# Altium schematic sheet ETL_RB.SchDoc: ETL Readout Board
size A; DrawnBy: anp sxw; Organization: Boston University EDF; DocumentNumber: 1; Revision: 1; SheetNumber: 1; SheetTotal: 1
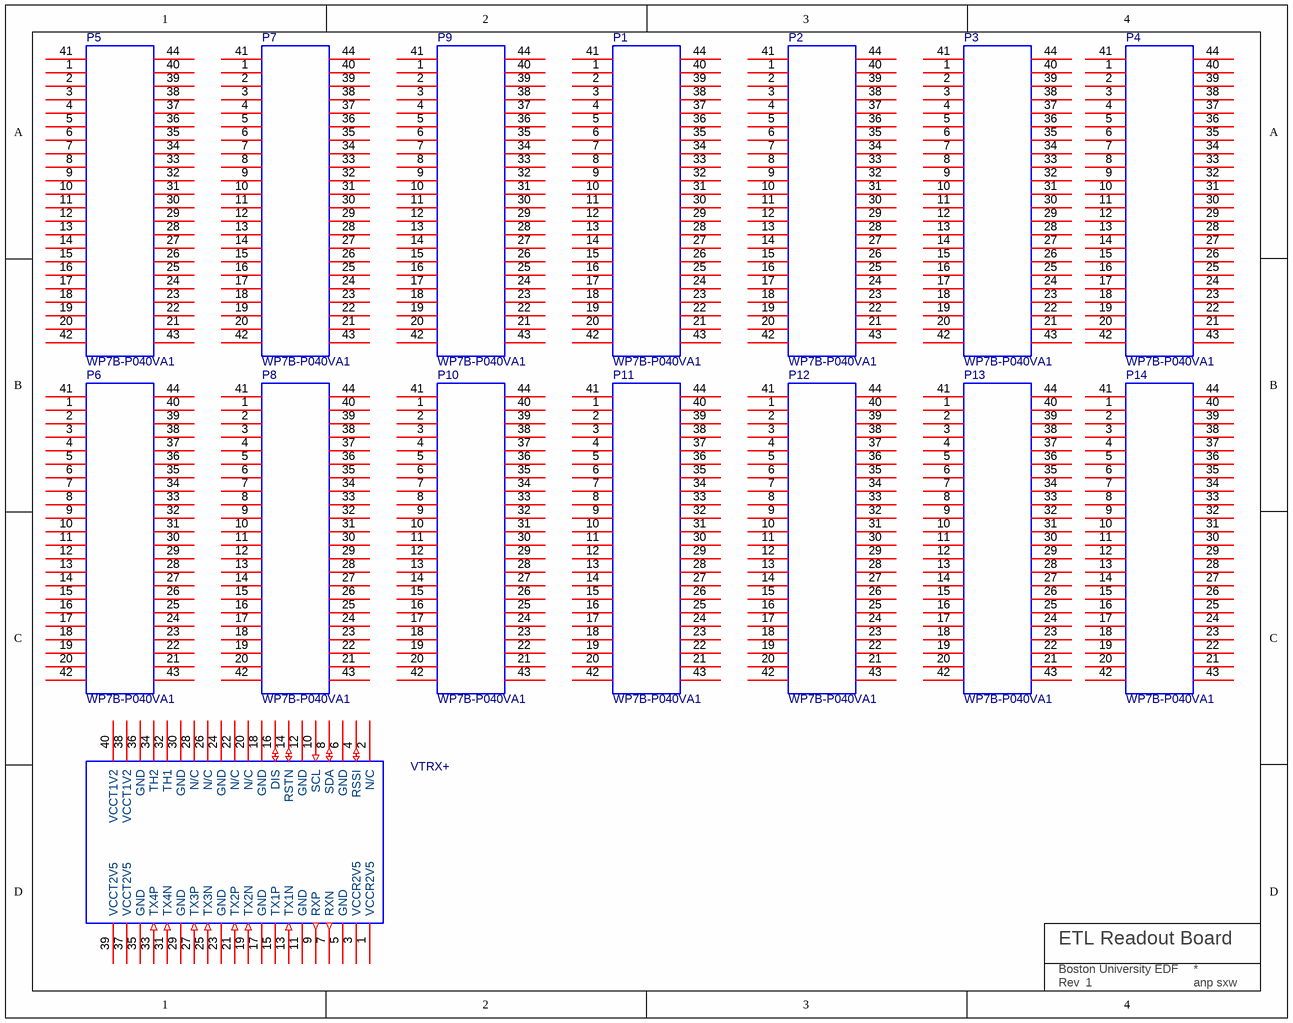
[diagram p0: ETL_RB.SchDoc]

## Parts
?  DF40C-40DS-0.4V  [vtrx+]  (value not drawn)
P1  WP7B-P040VA1  [wp7b-40p]
P2  WP7B-P040VA1  [wp7b-40p]
P3  WP7B-P040VA1  [wp7b-40p]
P4  WP7B-P040VA1  [wp7b-40p]
P5  WP7B-P040VA1  [wp7b-40p]
P6  WP7B-P040VA1  [wp7b-40p]
P7  WP7B-P040VA1  [wp7b-40p]
P8  WP7B-P040VA1  [wp7b-40p]
P9  WP7B-P040VA1  [wp7b-40p]
P10  WP7B-P040VA1  [wp7b-40p]
P11  WP7B-P040VA1  [wp7b-40p]
P12  WP7B-P040VA1  [wp7b-40p]
P13  WP7B-P040VA1  [wp7b-40p]
P14  WP7B-P040VA1  [wp7b-40p]
TBLOCK?  BU Title block  (value not drawn)  (graphical)

## Nets

Not connected (* = marked no-connect by the designer): ? 1(VCCR2V5) 2(N/C) 3(VCCR2V5) 4(RSSI) 5(GND) 6(GND) 7(RXN) 8(SDA) 9(RXP) 10(SCL) 11(GND) 12(GND) 13(TX1N) 14(RSTN) 15(TX1P) 16(DIS) 17(GND) 18(GND) 19(TX2N) 20(N/C) 21(TX2P) 22(N/C) 23(GND) 24(GND) 25(TX3N) 26(N/C) 27(TX3P) 28(N/C) 29(GND) 30(GND) 31(TX4N) 32(TH1) 33(TX4P) 34(TH2) 35(GND) 36(GND) 37(VCCT2V5) 38(VCCT1V2) 39(VCCT2V5) 40(VCCT1V2); P1 1 2 3 4 5 6 7 8 9 10 11 12 13 14 15 16 17 18 19 20 21 22 23 24 25 26 27 28 29 30 31 32 33 34 35 36 37 38 39 40 41 42 43 44; P2 1 2 3 4 5 6 7 8 9 10 11 12 13 14 15 16 17 18 19 20 21 22 23 24 25 26 27 28 29 30 31 32 33 34 35 36 37 38 39 40 41 42 43 44; P3 1 2 3 4 5 6 7 8 9 10 11 12 13 14 15 16 17 18 19 20 21 22 23 24 25 26 27 28 29 30 31 32 33 34 35 36 37 38 39 40 41 42 43 44; P4 1 2 3 4 5 6 7 8 9 10 11 12 13 14 15 16 17 18 19 20 21 22 23 24 25 26 27 28 29 30 31 32 33 34 35 36 37 38 39 40 41 42 43 44; P5 1 2 3 4 5 6 7 8 9 10 11 12 13 14 15 16 17 18 19 20 21 22 23 24 25 26 27 28 29 30 31 32 33 34 35 36 37 38 39 40 41 42 43 44; P6 1 2 3 4 5 6 7 8 9 10 11 12 13 14 15 16 17 18 19 20 21 22 23 24 25 26 27 28 29 30 31 32 33 34 35 36 37 38 39 40 41 42 43 44; P7 1 2 3 4 5 6 7 8 9 10 11 12 13 14 15 16 17 18 19 20 21 22 23 24 25 26 27 28 29 30 31 32 33 34 35 36 37 38 39 40 41 42 43 44; P8 1 2 3 4 5 6 7 8 9 10 11 12 13 14 15 16 17 18 19 20 21 22 23 24 25 26 27 28 29 30 31 32 33 34 35 36 37 38 39 40 41 42 43 44; P9 1 2 3 4 5 6 7 8 9 10 11 12 13 14 15 16 17 18 19 20 21 22 23 24 25 26 27 28 29 30 31 32 33 34 35 36 37 38 39 40 41 42 43 44; P10 1 2 3 4 5 6 7 8 9 10 11 12 13 14 15 16 17 18 19 20 21 22 23 24 25 26 27 28 29 30 31 32 33 34 35 36 37 38 39 40 41 42 43 44; P11 1 2 3 4 5 6 7 8 9 10 11 12 13 14 15 16 17 18 19 20 21 22 23 24 25 26 27 28 29 30 31 32 33 34 35 36 37 38 39 40 41 42 43 44; P12 1 2 3 4 5 6 7 8 9 10 11 12 13 14 15 16 17 18 19 20 21 22 23 24 25 26 27 28 29 30 31 32 33 34 35 36 37 38 39 40 41 42 43 44; P13 1 2 3 4 5 6 7 8 9 10 11 12 13 14 15 16 17 18 19 20 21 22 23 24 25 26 27 28 29 30 31 32 33 34 35 36 37 38 39 40 41 42 43 44; P14 1 2 3 4 5 6 7 8 9 10 11 12 13 14 15 16 17 18 19 20 21 22 23 24 25 26 27 28 29 30 31 32 33 34 35 36 37 38 39 40 41 42 43 44

## Notes on the sheet
- (in symbol TITLE_BLOCK_BU) Rev

## Library data of the parts
? = VTRX+_DF40C-2.0-40DS-0.4V: VTRX+ module with 2.5mm stack Height.; Parameter 1: VTRX+
P1-P14 = WP7B-40P: plug
TBLOCK? = TITLE_BLOCK_BU